# EasyEDA Pro project ProPrj_hid-remapper-v2_2026-05-31.epro

# Schematic Schematic1
Board Name: Board1; Create Date: 2026-05-15; Page Name: P1; Project Name: hid-remapper-v2; Schematic Name: Schematic1; Update Date: 2026-05-15; Company: EasyEDA.com; Page Size: A4; Version: V1.0
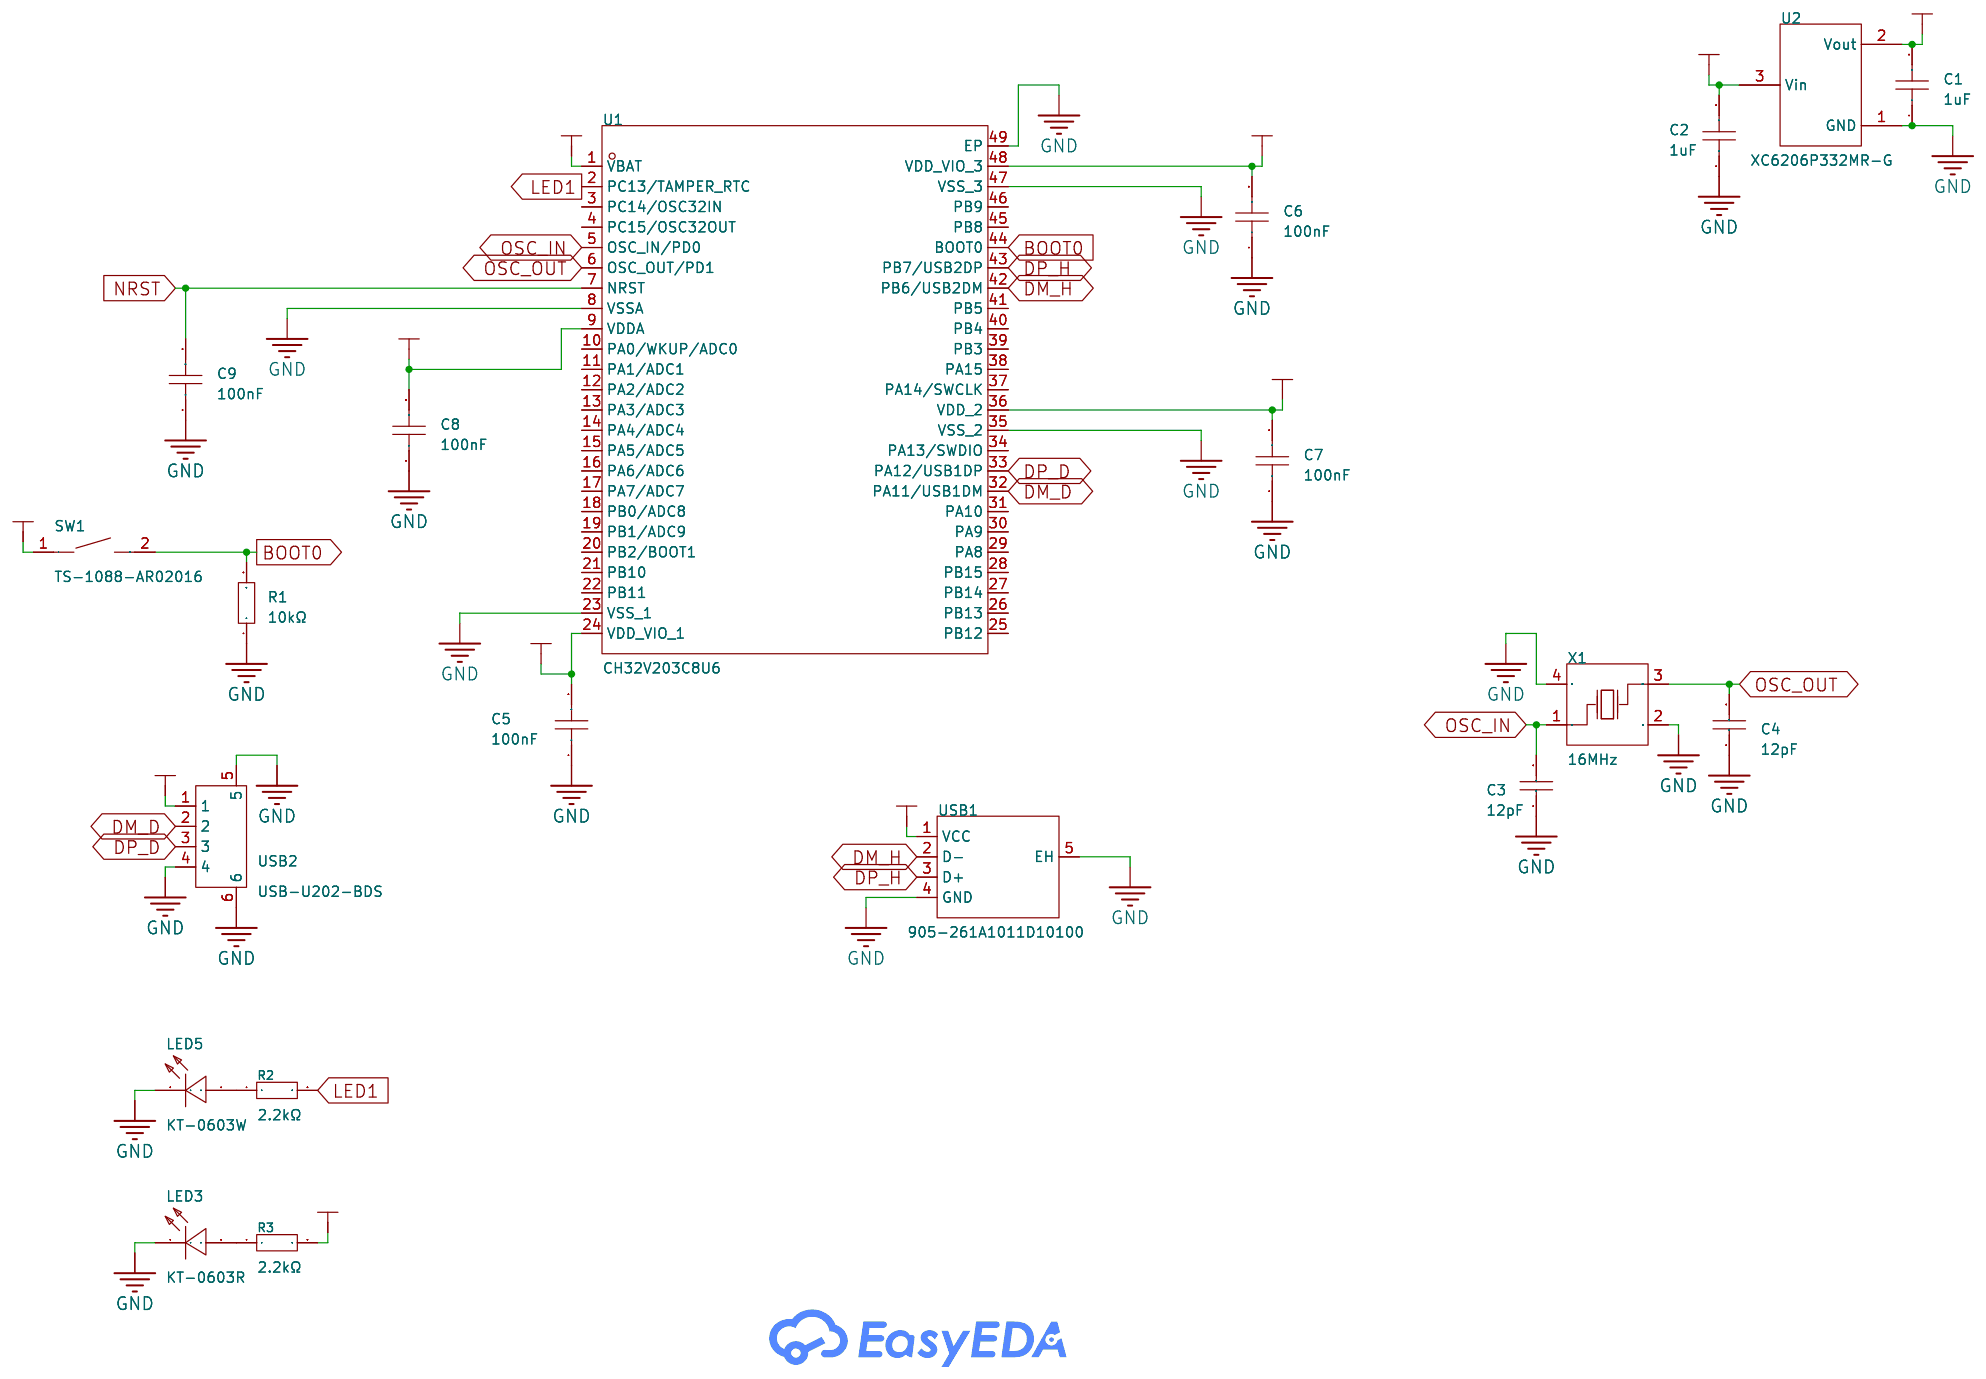
[diagram p0: schematic sheet]

## Parts
C1  1uF  [C0402]
C2  1uF  [C0402]
C3  12pF  [C0402]
C4  12pF  [C0402]
C5  100nF  [C0402]
C6  100nF  [C0402]
C7  100nF  [C0402]
C8  100nF  [C0402]
C9  100nF  [C0402]
LED3  KT-0603R  [LED0603-RD]
LED5  KT-0603W  [LED0603-R-RD_WHITE]
R1  10kΩ  [R0402]
R2  2.2kΩ  [R0402]
R3  2.2kΩ  [R0402]
SW1  TS-1088-AR02016  [SW-SMD_L3.9-W3.0-P4.45]
U1  CH32V203C8U6  [TQFN-48_L7.0-W7.0-P0.50-BL-EP5.5]
U2  XC6206P332MR-G  [SOT-23-3_L2.9-W1.6-P1.90-LS2.8-BR]
USB1  905-261A1011D10100  [USB-A-TH_JTJ-USB-AF-13]
USB2  USB-U202-BDS  [USB_USB-U202-BDS]
X1  16MHz  [OSC-SMD_4P-L3.2-W2.5-BL]

## Library data of the parts
C1 C2 = CL05A105KA5NQNC: Capacitance:1uF Tolerance:±10% Tolerance:±10% Voltage Rating:25V Temperature Coefficient:X5R; LCSC Part Name: 1uF ±10% 25V; Supplier Part: C52923; Manufacturer: SAMSUNG(三星); Supplier Footprint: 0402; JLCPCB Part Class: Basic Part; Datasheet: https://item.szlcsc.com/datasheet/CL05A105KA5NQNC/53938.html; Supplier: LCSC; Tolerance: ±10%; Voltage Rating: 25V; Temperature Coefficient: X5R
C3 C4 = 0402CG120J500NT: Capacitance:12pF Tolerance:±5% Tolerance:±5% Voltage Rating:50V Temperature Coefficient:C0G; LCSC Part Name: 12pF ±5% 50V; Supplier Part: C1547; Manufacturer: FH(风华); Supplier Footprint: 0402; Datasheet: https://item.szlcsc.com/datasheet/0402CG120J500NT/1899.html; Supplier: LCSC; Tolerance: ±5%; Voltage Rating: 50V; Temperature Coefficient: C0G
C5-C9 = CL05B104KO5NNNC: Capacitance:100nF Tolerance:±10% Tolerance:±10% Voltage Rating:16V Temperature Coefficient:X7R; LCSC Part Name: 100nF ±10% 16V; Supplier Part: C1525; Manufacturer: SAMSUNG(三星); Supplier Footprint: 0402; JLCPCB Part Class: Basic Part; Datasheet: https://item.szlcsc.com/datasheet/CL05B104KO5NNNC/1877.html; Supplier: LCSC; Tolerance: ±10%; Voltage Rating: 16V; Temperature Coefficient: X7R
LED3 = KT-0603R: Lamp Holder Type:1.6mm x 0.8mm square LED Illumination Color:Red Voltage - Forward(Vf):1.8V~2.4V Voltage - Forward(Vf):1.8V~2.4V Power(Watts):40mW Forward Current:20mA Wavelength - Dominant:615nm~630nm Wavelength - Dominant:615nm~630nm Peak Wavelength:645; LCSC Part Name: 0603 红灯 高亮; Supplier Part: C2286; Manufacturer: KENTO; Supplier Footprint: 0603; Datasheet: https://item.szlcsc.com/datasheet/KT-0603R/2659.html; Supplier: LCSC; Lamp Holder Type: 1.6mm x 0.8mm square LED; Illumination Color: Red; Voltage - Forward(Vf): 1.8V~2.4V; Power(Watts): 40mW; Forward Current: 20mA; Wavelength - Dominant: 615nm~630nm; Peak Wavelength: 645nm; Diode Configuration: Discrete Diode; Lens Color: Water Clear; Luminous Intensity: 300mcd; Viewing Angle: 120°; Operating Temperature: -40℃~+85℃
LED5 = KT-0603W: Lamp Holder Type:1.6mm x 0.8mm square LED Illumination Color:White Voltage - Forward(Vf):2.6V~3.1V Voltage - Forward(Vf):2.6V~3.1V Power(Watts):100mW Forward Current:5mA Wavelength - Dominant:- Wavelength - Dominant:- Peak Wavelength:- Peak Wavelength:- D; LCSC Part Name: 0603 白灯 高亮; Supplier Part: C2290; Manufacturer: KENTO; Supplier Footprint: 0603; Datasheet: https://item.szlcsc.com/datasheet/KT-0603W/2663.html; Supplier: LCSC; Lamp Holder Type: 1.6mm x 0.8mm square LED; Illumination Color: White; Voltage - Forward(Vf): 2.6V~3.1V; Power(Watts): 100mW; Forward Current: 5mA; Diode Configuration: Discrete Diode; Lens Color: Yellow Lens; Color Temperature: 40000K~100000K; Luminous Intensity: 360mcd; Viewing Angle: 120°; Mounting Style: Top-mount; Operating Temperature: -40℃~+85℃
R1 = 0402WGF1002TCE: Type:Thick Film Resistor Resistance:10kΩ Tolerance:±1% Tolerance:±1% Power(Watts):62.5mW Voltage-Supply(Max):50V Temperature Coefficient:±100ppm/℃ Temperature Coefficient:±100ppm/℃ Operating Temperature:-55℃~+155℃ Operating Temperature:-55℃~+155℃; LCSC Part Name: 10kΩ ±1% 62.5mW 厚膜电阻; Supplier Part: C25744; Manufacturer: UNI-ROYAL(厚声); Supplier Footprint: 0402; Datasheet: https://item.szlcsc.com/datasheet/0402WGF1002TCE/26487.html; Supplier: LCSC; Type: Thick Film Resistor; Tolerance: ±1%; Power(Watts): 62.5mW; Voltage-Supply(Max): 50V; Temperature Coefficient: ±100ppm/℃; Operating Temperature: -55℃~+155℃
R2 R3 = 0402WGF2201TCE: Type:Thick Film Resistor Resistance:2.2kΩ Tolerance:±1% Tolerance:±1% Power(Watts):62.5mW Voltage-Supply(Max):50V Temperature Coefficient:±100ppm/℃ Temperature Coefficient:±100ppm/℃ Operating Temperature:-55℃~+155℃ Operating Temperature:-55℃~+155℃; LCSC Part Name: 2.2kΩ ±1% 62.5mW 厚膜电阻; Supplier Part: C25879; Manufacturer: UNI-ROYAL(厚声); Supplier Footprint: 0402; Datasheet: https://item.szlcsc.com/datasheet/0402WGF2201TCE/26622.html; Supplier: LCSC; Type: Thick Film Resistor; Tolerance: ±1%; Power(Watts): 62.5mW; Voltage-Supply(Max): 50V; Temperature Coefficient: ±100ppm/℃; Operating Temperature: -55℃~+155℃
SW1 = TS-1088-AR02016: Circuit:SPST Actuator Style:Round Button Operating Force:1.6N Mounting Type:Surface Mount,Vertical Length:4mm Width:3mm Switch Height:2mm with Bracket:Without Bracket Contact Current:50mA Voltage Rating:12V Actuator/Cap Color:Black Termination Style:SMD(S; LCSC Part Name: 4*3*2mm 立贴 轻触开关; Supplier Part: C720477; Manufacturer: XUNPU(讯普); Supplier Footprint: SMD,4x3mm; Datasheet: https://item.szlcsc.com/datasheet/TS-1088-AR02016/763484.html; Supplier: LCSC; Circuit: SPST; Actuator Style: Round Button; Operating Force: 1.6N; Mounting Type: Surface Mount,Vertical; Length: 4mm; Width: 3mm; Switch Height: 2mm; with Bracket: Without Bracket; Contact Current: 50mA; Voltage Rating: 12V; Actuator/Cap Color: Black; Termination Style: SMD(SMT) Tab; Life: 100,000 Cycles; Operating Temperature: -30℃~+80℃
U1 = CH32V203C8U6: Supplier Part: C6407762; Manufacturer: WCH(南京沁恒); Supplier Footprint: QFN-48(7x7); JLCPCB Part Class: Extended Part; Datasheet: https://item.szlcsc.com/datasheet/CH32V203C8U6/7359104.html; Supplier: LCSC
U2 = XC6206P332MR-G_C5446: Output Type:Fixed Voltage - Supply:6V Output Voltage:3.3V Output Voltage:3.3V Output Current:200mA Power Supply Rejection Ratio (PSRR):- Voltage Dropout:- standby current:1uA Noise:- Features:Over Current Protection Operating Temperature:-40℃~+85℃@(Ta) Op; LCSC Part Name: 3.3V 200mA 6V; Supplier Part: C5446; Manufacturer: TOREX(特瑞仕); Supplier Footprint: SOT-23-3L; JLCPCB Part Class: Basic Part; Datasheet: https://item.szlcsc.com/datasheet/XC6206P332MR-G/5896.html; Supplier: LCSC; Output Type: Fixed; Voltage - Supply: 6V; Output Voltage: 3.3V; Output Current: 200mA; standby current: 1uA; Features: Over Current Protection; Operating Temperature: -40℃~+85℃@(Ta); Output Configuration: Positive; Number of Outputs: 1
USB1 = 905-261A1011D10100: Connector Type:Type-A Protocol Standard:USB 2.0 Gender:Female Mounting Type:Laminated board Number of Contacts:4P Number of Ports:1 Current Rating-Power:1.5A Voltage Rating:30V Length:14.1mm Detection color:White Operating Temperature:-35℃~+85℃ Operating; LCSC Part Name: Type-A 母 沉板; Supplier Part: C42614; Manufacturer: 精拓金; Supplier Footprint: 插件; JLCPCB Part Class: Extended Part; Datasheet: https://item.szlcsc.com/datasheet/905-261A1011D10100/43605.html; Supplier: LCSC; Connector Type: Type-A; Protocol Standard: USB 2.0; Gender: Female; Mounting Type: Laminated board; Number of Contacts: 4P; Number of Ports: 1; Current Rating-Power: 1.5A; Voltage Rating: 30V; Length: 14.1mm; Detection color: White; Operating Temperature: -35℃~+85℃
USB2 = USB-U202-BDS: Connector Type:Type-A Protocol Standard:USB 2.0 Gender:Male Mounting Type:Right Angle Number of Contacts:4P Number of Ports:1 Current Rating-Power:1.5A Voltage Rating:30V Connect-Disconnect Life:1500 Cycles Length:20mm Operating Temperature:0℃~+50℃ Operat; LCSC Part Name: Type-A 公 弯插; Supplier Part: C2962377; Manufacturer: HANBO(汉博); Supplier Footprint: 弯插; Datasheet: https://item.szlcsc.com/datasheet/USB-U202-BDS/3352869.html; Supplier: LCSC; Connector Type: Type-A; Protocol Standard: USB 2.0; Gender: Male; Mounting Type: Right Angle; Number of Contacts: 4P; Number of Ports: 1; Current Rating-Power: 1.5A; Voltage Rating: 30V; Connect-Disconnect Life: 1500 Cycles; Length: 20mm; Operating Temperature: 0℃~+50℃
X1 = X322516MLB4SI: Type:Crystal Oscillator Frequency:16MHz Normal temperature Frequency Tolerance:±10ppm Normal temperature Frequency Tolerance:±10ppm Load Capacitance:9pF Frequency Stability:±20ppm Frequency Stability:±20ppm Operating Temperature:-40℃~+85℃ Operating Temper; LCSC Part Name: YSX321SL 16MHZ 4P 3225 9PF ±10PPM -40~85℃ (±20PPM); Supplier Part: C13738; Manufacturer: YXC(扬兴晶振); Supplier Footprint: SMD3225-4P; Datasheet: https://item.szlcsc.com/datasheet/X322516MLB4SI/14393.html; Supplier: LCSC; Type: Crystal Oscillator; Normal temperature Frequency Tolerance: ±10ppm; Load Capacitance: 9pF; Frequency Stability: ±20ppm; Operating Temperature: -40℃~+85℃

## Nets
3V3: C1.2 C5.2 C6.2 C7.2 C8.2 R3.2 SW1.1 U1.1(VBAT) U1.9(VDDA) U1.24(VDD_VIO_1) U1.36(VDD_2) U1.48(VDD_VIO_3) U2.2(Vout)
GND: C1.1 C2.1 C3.1 C4.1 C5.1 C6.1 C7.1 C8.1 C9.1 LED3.1(K) LED5.2(K) R1.1 U1.8(VSSA) U1.23(VSS_1) U1.35(VSS_2) U1.47(VSS_3) U1.49(EP) U2.1(GND) USB1.4(GND) USB1.5(EH) USB2.4 USB2.5 USB2.6 X1.2(GND) X1.4(GND)
VBUS: C2.2 U2.3(Vin) USB1.1(VCC) USB2.1
BOOT0: R1.2 SW1.2 U1.44(BOOT0)
DM_D: U1.32(PA11/USB1DM) USB2.2
DM_H: U1.42(PB6/USB2DM) USB1.2(D-)
DP_D: U1.33(PA12/USB1DP) USB2.3
DP_H: U1.43(PB7/USB2DP) USB1.3(D+)
LED1: R2.2 U1.2(PC13/TAMPER_RTC)
NRST: C9.2 U1.7(NRST)
OSC_IN: C3.2 U1.5(OSC_IN/PD0) X1.1(OSC1)
OSC_OUT: C4.2 U1.6(OSC_OUT/PD1) X1.3(OSC2)
$1N4348: LED3.2(A) R3.1
$1N4350: LED5.1(A) R2.1

Not connected (* = marked no-connect by the designer): U1 3(PC14/OSC32IN) 4(PC15/OSC32OUT) 10(PA0/WKUP/ADC0) 11(PA1/ADC1) 12(PA2/ADC2) 13(PA3/ADC3) 14(PA4/ADC4) 15(PA5/ADC5) 16(PA6/ADC6) 17(PA7/ADC7) 18(PB0/ADC8) 19(PB1/ADC9) 20(PB2/BOOT1) 21(PB10) 22(PB11) 25(PB12) 26(PB13) 27(PB14) 28(PB15) 29(PA8) 30(PA9) 31(PA10) 34(PA13/SWDIO) 37(PA14/SWCLK) 38(PA15) 39(PB3) 40(PB4) 41(PB5) 45(PB8) 46(PB9)

# Board PCB1
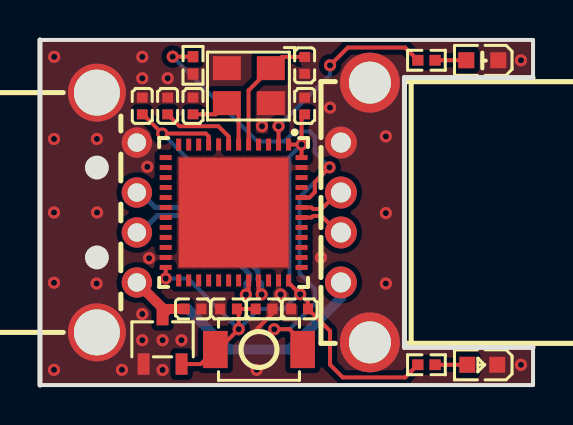
[diagram p1: board, top side]
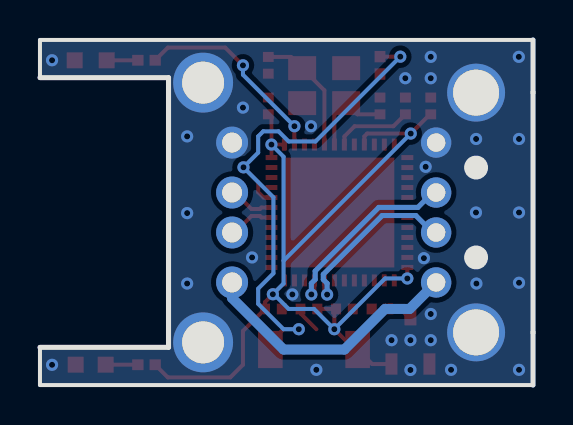
[diagram p2: board, bottom side, seen from below]

Outline 24.68 x 17.27 mm; copper layers: Top Layer, Bottom Layer. Coordinates in mm from the lower left corner of the outline.
Outline path: 0,14.65 0,17.27 24.68,17.27 24.68,15.39 18.24,15.39 ; 0,2.63 0,0 24.68,0 24.68,1.89 18.24,1.89
Stack: Top Layer 0.035mm / Dielectric1 1.51mm FR4 er 4.5 / Bottom Layer 0.035mm

## Design rules (mm)
net OSC_IN: DP3
net OSC_OUT: DP3
net DM_D: DP1
net DP_D: DP1
net DM_H: DP2
net DP_H: DP2
template: Custom Config
spacing copperThickness1oz (default): track to track 0.102, other pairs 0.152 to 0.3
spacing copperThickness2oz: track to track 0.203, other pairs 0.152 to 0.3
track width copperThickness1oz (default): min 0.127, default 0.2, max 2.54
track width copperThickness2oz: min 0.203, default 0.254, max 2.54
differential pair differentialPair (default): width min 0.127, default 0.254, max 2.54; gap min 0.152, default 0.152
via viaSize (default): diameter min 0.5, default 0.61, max 10; hole min 0.3, default 0.305, max 6.3

## Placement (name value [footprint] x y rotation side)
C1  1uF  [C0402]  11.22 3.81 180 top
C2  1uF  [C0402]  7.66 3.81 180 top
C3  12pF  [C0402]  13.25 16 90 top
C4  12pF  [C0402]  7.66 13.97 270 top
C5  100nF  [C0402]  9.44 3.81 0 top
C6  100nF  [C0402]  13.25 13.97 270 top
C7  100nF  [C0402]  12.99 3.81 0 top
C8  100nF  [C0402]  5.12 13.97 270 top
C9  100nF  [C0402]  6.39 13.97 270 top
LED3  KT-0603R  [LED0603-RD]  22.14 1.02 180 top
LED5  KT-0603W  [LED0603-R-RD_WHITE]  22.14 16.26 180 top
R1  10kΩ  [R0402]  7.66 16 90 top
R2  2.2kΩ  [R0402]  19.34 16.26 180 top
R3  2.2kΩ  [R0402]  19.34 1.02 180 top
SW1  TS-1088-AR02016  [SW-SMD_L3.9-W3.0-P4.45]  10.96 1.78 0 top
U1  CH32V203C8U6  [TQFN-48_L7.0-W7.0-P0.50-BL-EP5.5]  9.69 8.64 180 top
U2  XC6206P332MR-G  [SOT-23-3_L2.9-W1.6-P1.90-LS2.8-BR]  6.14 2.29 270 top
USB1  905-261A1011D10100  [USB-A-TH_JTJ-USB-AF-13]  15.79 8.64 90 top
USB2  USB-U202-BDS  [USB_USB-U202-BDS]  3.85 8.64 180 top
X1  16MHz  [OSC-SMD_4P-L3.2-W2.5-BL]  10.45 14.99 180 top

## Footprints (pads in the part's own frame, mm; a bottom-side part is the same pattern mirrored in y, then rotated)
C0402
  rect 0.5x0.54 smd: 1(-0.42,0) 2(0.42,0)
LED0603-R-RD_WHITE
  rect 0.8x0.8 smd: 1(0.8,0) 2(-0.8,0)
LED0603-RD
  rect 0.8x0.8 smd: 1(-0.749,0) 2(0.749,0)
OSC-SMD_4P-L3.2-W2.5-BL
  rect 1.4x1.2 smd: 1(-1.1,-0.875) 2(1.1,-0.875) 3(1.1,0.875) 4(-1.1,0.875)
R0402
  rect 0.566x0.54 smd: 1(-0.433,0) 2(0.433,0)
SOT-23-3_L2.9-W1.6-P1.90-LS2.8-BR
  rect 1.07x0.6 smd: 1(1.235,-0.95) 2(1.235,0.95) 3(-1.235,0)
SW-SMD_L3.9-W3.0-P4.45
  rect 1.23x1.86 smd: 1(-2.185,0) 2(2.185,0)
TQFN-48_L7.0-W7.0-P0.50-BL-EP5.5
  rect 0.25x0.6 smd: 1(-2.75,-3.4) 2(-2.25,-3.4) 3(-1.75,-3.4) 4(-1.25,-3.4) 5(-0.75,-3.4) 6(-0.25,-3.4) 7(0.25,-3.4) 8(0.75,-3.4) 9(1.25,-3.4) 10(1.75,-3.4) 11(2.25,-3.4) 12(2.75,-3.4) 25(2.75,3.4) 26(2.25,3.4) 27(1.75,3.4) 28(1.25,3.4) 29(0.75,3.4) 30(0.25,3.4) 31(-0.25,3.4) 32(-0.75,3.4) 33(-1.25,3.4) 34(-1.75,3.4) 35(-2.25,3.4) 36(-2.75,3.4)
  rect 0.6x0.25 smd: 13(3.4,-2.75) 14(3.4,-2.25) 15(3.4,-1.75) 16(3.4,-1.25) 17(3.4,-0.75) 18(3.4,-0.25) 19(3.4,0.25) 20(3.4,0.75) 21(3.4,1.25) 22(3.4,1.75) 23(3.4,2.25) 24(3.4,2.75) 37(-3.4,2.75) 38(-3.4,2.25) 39(-3.4,1.75) 40(-3.4,1.25) 41(-3.4,0.75) 42(-3.4,0.25) 43(-3.4,-0.25) 44(-3.4,-0.75) 45(-3.4,-1.25) 46(-3.4,-1.75) 47(-3.4,-2.25) 48(-3.4,-2.75)
  rect 5.5x5.5 smd: 49(0,0)
USB-A-TH_JTJ-USB-AF-13
  round 1.6 hole 1: 1(-3.5,0.725) 2(-1,0.725) 3(1,0.725) 4(3.5,0.725)
  round 3 hole 2.1: 5(-6.5,-0.725) 5(6.5,-0.725)
USB_USB-U202-BDS
  round 1.52 hole 0.92: 1(-1,3.5) 2(-1,1) 3(-1,-1) 4(-1,-3.5)
  round 2.9 hole 2.3: 5(1,6) 6(1,-6)

## Nets
As in the schematic.

Pads without a net: U1 3 4 10 11 12 13 14 15 16 17 18 19 20 21 22 25 26 27 28 29 30 31 34 37 38 39 40 41 45 46

## Via types
v1: diameter 0.61, hole 0.305, Top Layer to Bottom Layer, 41 vias

## Routing (per net, layer and track width the routed paths; a pad name or vN(x,y) marks a point on that pad's centre or on a via; arc(x,y) is an arc through that point)
3V3: length 48.6
  Top Layer w0.2: U1.1 v1(13.09,12.04) ; v1(13.09,12.04) 13.09,13.39 C6.2 ; v1(13.09,12.04) U1.48 ; U2.2 8.05,1.05 SW1.1 8.93,1.78 v1(9.95,2.79) 9.95,3.72 C5.2 C1.2 ; U1.9 8.44,12.45 8.3,12.59 v1(6.12,12.59) 5.16,13.55 C8.2 ; R3.2 18.28,0.38 15.15,0.38 14.52,1.02 14.52,2.71 C7.2 13.41,4.15 v1(13.02,4.54) 12.44,5.12 U1.36 ; v1(6.29,5.33) U1.24
  Bottom Layer w0.2: v1(13.09,12.04) 12.49,11.43 12.49,6.22 ; 12.49,6.22 12.49,5.08 12.99,4.57 12.23,3.81 10.96,3.81 v1(9.95,2.79) 7.41,5.33 v1(6.29,5.33) ; 12.49,6.22 v1(6.12,12.59)
GND: length 1.3
  Top Layer w0.2: C1.1 11.64,3.58 10.85,2.79
  vias: v1(0.71,16.43) v1(0.7,12.32) v1(0.7,8.64) v1(0.7,5.12) v1(0.7,0.76) v1(2.85,12.32) v1(2.86,8.64) v1(2.83,5.08) v1(4.1,0.76) v1(5.12,16.43) v1(5.12,15.36) v1(5.12,3.56) v1(5.12,2.25) v1(5.37,10.92) v1(5.46,6.35) v1(6.14,2.25) v1(6.14,0.75) v1(6.39,15.36) v1(7.08,2.25) v1(10.85,0.76) v1(11.11,12.95) v1(12.05,4.53) v1(14.06,6.39) v1(14.52,13.89) v1(17.31,12.45) v1(17.31,8.6) v1(17.31,5.08) v1(24.07,16.26) v1(24.07,1.01)
VBUS: length 16.8
  Top Layer w0.5: USB2.1 6.14,3.85 U2.3 6.42,3.81 C2.2
  Bottom Layer w0.5: USB2.1 6.18,3.81 7.41,3.81 9.44,1.78 12.49,1.78 15.06,4.35 USB1.1
BOOT0: length 26.8
  Top Layer w0.2: SW1.2 13.15,2.13 12.49,2.79 v1(11.72,2.79) ; v1(14.49,10.9) 13.76,10.16 13.76,9.65 13.49,9.39 U1.44 ; R1.2 v1(6.64,16.44)
  Bottom Layer w0.2: v1(11.72,2.79) 12.49,2.79 13.76,4.06 13.76,4.83 12.99,5.59 12.99,9.4 v1(14.49,10.9) 13.76,11.63 13.76,12.45 13.5,12.7 12.74,12.7 12.23,12.19 10.89,12.19 v1(6.64,16.44)
DM_D: length 9.1
  Top Layer w0.2: v1(10.31,4.53) 10.44,4.66 U1.32
  Bottom Layer w0.254: v1(10.31,4.53) 10.31,5.09 10.5,5.28 10.5,5.54 7.55,8.48 5.87,8.48 5.02,7.64 USB2.2
DM_H: length 2.3
  Top Layer w0.2: USB1.2 14.92,7.64 14.09,8.46 13.67,8.46 13.59,8.39 U1.42
DP_D: length 9.7
  Top Layer w0.2: v1(11.09,4.53) 10.94,4.69 U1.33
  Bottom Layer w0.254: USB2.3 5.02,9.64 5.76,8.89 7.72,8.89 10.9,5.71 10.9,5.28 11.09,5.09 v1(11.09,4.53)
DP_H: length 2.3
  Top Layer w0.2: U1.43 13.59,8.89 13.67,8.81 14.09,8.81 14.92,9.64 USB1.3
LED1: length 10.1
  Top Layer w0.2: R2.2 18.28,16.89 15.4,16.89 v1(14.52,16) ; U1.2 v1(11.94,12.95)
  Bottom Layer w0.2: v1(11.94,12.95) 14.52,15.53 v1(14.52,16)
NRST: length 3.9
  Top Layer w0.2: U1.7 9.44,12.04 9.44,12.45 8.93,12.95 6.99,12.95 C9.2
OSC_IN: length 6.2
  Top Layer w0.2: U1.5 10.44,14.75 X1.1 12.11,16.42 C3.2
OSC_OUT: length 4.2
  Top Layer w0.2: U1.6 9.94,13.52 X1.3 8.79,13.55 C4.2
$1N4348: length 1.6
  Top Layer w0.2: R3.1 LED3.2
$1N4350: length 1.6
  Top Layer w0.2: R2.1 LED5.1

## Copper pours and planes (outline as drawn; the poured copper is in the pictures)
GND on Top Layer: 0,17.27 27.73,17.27 27.73,0 0,0
GND on Bottom Layer: 0,17.27 27.73,17.27 27.73,0 0,0
